# Altium schematic sheet Room485.SchDoc
size A4
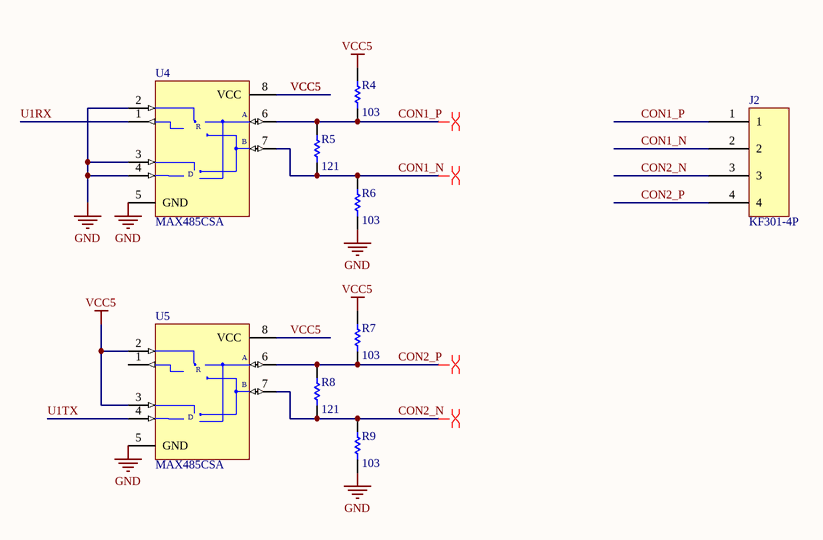
[diagram p0: Room485.SchDoc]

## Parts
J2  KF301-4P  [KF301-4P]
R4  value 103  [RESC3216L]  (hidden comment: Res Semi)
R5  value 121  [RESC3216L]  (hidden comment: Res Semi)
R6  value 103  [RESC3216L]  (hidden comment: Res Semi)
R7  value 103  [RESC3216L]  (hidden comment: Res Semi)
R8  value 121  [RESC3216L]  (hidden comment: Res Semi)
R9  value 103  [RESC3216L]  (hidden comment: Res Semi)
U4  MAX485CSA  [NSO8_N]
U5  MAX485CSA  [NSO8_N]

## Nets
GND: R6.1 R9.1 U4.2(~{RE}) U4.3(DE) U4.4(DI) U4.5(GND) U5.5(GND)
VCC5: R4.2 R7.2 U4.8(VCC) U5.2(~{RE}) U5.3(DE) U5.8(VCC)
CON1_N: J2.2 R5.1 R6.2 U4.7(B)
CON1_P: J2.1 R4.1 R5.2 U4.6(A)
CON2_N: J2.3 R8.1 R9.2 U5.7(B)
CON2_P: J2.4 R7.1 R8.2 U5.6(A)
U1RX: U4.1(RO)
U1TX: U5.4(DI)

Not connected (* = marked no-connect by the designer): U5 1(RO)

## Layout directives
differential pair: CON1_N, CON1_P, CON2_N, CON2_P

## Notes on the sheet
- (in symbol MAX485CSA) R; D

## Library data of the parts
R4-R9 = Res Semi: Semiconductor Resistor; Published: 8-Jun-2000; LatestRevisionDate: 17-Jul-2002; LatestRevisionNote: Re-released for DXP Platform.; PackageReference: AXIAL-0.5; Publisher: Altium Limited
U4 U5 = MAX485CSA: Low-Power, Slew-Rate-Limited RS-485/RS-422 Transceiver; Published: 16-Jan-2001; LatestRevisionDate: 13-Apr-2006; LatestRevisionNote: IPC-7351 Footprint Added.; DatasheetVersion: Feb-1996; PackageReference: NSO8; Publisher: Altium Limited; PackageDescription: 8-Pin Small Outline Integrated Circuit 1.27 mm Pitch; Code_JEDEC: MS-012-AA; Code_IPC: SOIC127P600-8; ComponentLink1Description: Manufacturer Link; ComponentLink1URL: http://www.maxim-ic.com/; ComponentLink2Description: Datasheet; ComponentLink2URL: http://pdfserv.maxim-ic.com/en/ds/MAX1487-MAX491.pdf